# Altium schematic sheet Sheet4.SchDoc
size A4
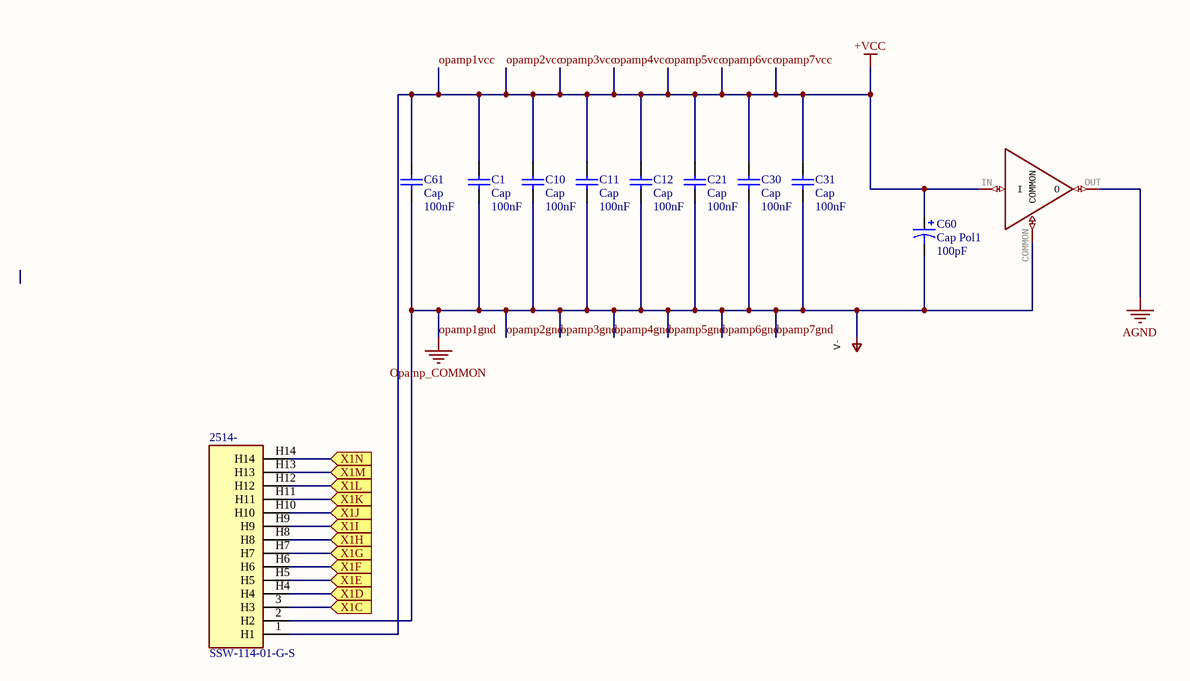
[diagram p0: Sheet4.SchDoc]

## Parts
2514-  SSW-114-01-G-S  [SHDR14W79P0X254_1X14_3607X241X851P]
C1  Cap  value 100nF  [SMD_CAPACITOR]
C10  Cap  value 100nF  [SMD_CAPACITOR]
C11  Cap  value 100nF  [SMD_CAPACITOR]
C12  Cap  value 100nF  [SMD_CAPACITOR]
C21  Cap  value 100nF  [SMD_CAPACITOR]
C30  Cap  value 100nF  [SMD_CAPACITOR]
C31  Cap  value 100nF  [SMD_CAPACITOR]
C60  Cap Pol1  value 100pF  [SMD_POLAR_CAPACITOR]
C61  Cap  value 100nF  [SMD_CAPACITOR]
P-25  V-
U?  TLE2426  [SOIC127P600X175-8N]  (value not drawn)

## Ports
X1C (in), X1D (in), X1E (in), X1F (in), X1G (in), X1H (in), X1I (in), X1J (in), X1K (in), X1L (in), X1M (in), X1N (in)

## Nets
AGND: U?.OUT(O)
opamp1gnd: 2514-.2(H2) C1.1 C10.1 C11.1 C12.1 C21.1 C30.1 C31.1 C60.2 C61.1 P-25.?1(V-) U?.COMMON  [also labelled opamp2gnd, opamp3gnd, opamp4gnd, opamp5gnd, opamp6gnd, opamp7gnd, Opamp_COMMON]
opamp1vcc: 2514-.1(H1) C1.2 C10.2 C11.2 C12.2 C21.2 C30.2 C31.2 C60.1 C61.2 U?.IN(I)  [also labelled +VCC, opamp2vcc, opamp3vcc, opamp4vcc, opamp5vcc, opamp6vcc, opamp7vcc]
X1C: 2514-.3(H3) ; port X1C
X1D: 2514-.H4 ; port X1D
X1E: 2514-.H5 ; port X1E
X1F: 2514-.H6 ; port X1F
X1G: 2514-.H7 ; port X1G
X1H: 2514-.H8 ; port X1H
X1I: 2514-.H9 ; port X1I
X1J: 2514-.H10 ; port X1J
X1K: 2514-.H11 ; port X1K
X1L: 2514-.H12 ; port X1L
X1M: 2514-.H13 ; port X1M
X1N: 2514-.H14 ; port X1N

## Library data of the parts
2514- = SSW-114-01-G-S: Capacitor; Manufacturer_Name: SAMTEC; Datasheet Link: http://suddendocs.samtec.com/prints/ssw-1xx-xx-xxx-x-xx-xxx-xx-mkt.pdf; Height: 8.51mm; Manufacturer_Part_Number: SSW-114-01-G-S
C1 C10-C12 C21 C30 C31 C61 = Cap: Capacitor; Published: 8-Jun-2000; LatestRevisionDate: 17-Jul-2002; LatestRevisionNote: Re-released for DXP Platform.; PackageReference: RAD-0.3; Publisher: Altium Limited; PackageDescription: Radial Cap, Thru-Hole; 2 Leads; 0.3 in Pin Spacing
C60 = Cap Pol1: Polarized Capacitor (Radial); Published: 8-Jun-2000; LatestRevisionDate: 17-Jul-2002; LatestRevisionNote: Re-released for DXP Platform.; PackageReference: RB7.6-15; Publisher: Altium Limited; PackageDescription: Polarized Capacitor (Radial); 2 Leads
P-25 = V-: SUPPLY SYMBOL; GateName_1: 1; SymbolName_1: V-; LibraryName: supply1; DeviceSetName: V-
U? = TLE2426: GateName_1: G$1; SymbolName_1: TLE2426; LibraryName: MyLib_SD; DeviceSetName: TLE2426